# Altium schematic sheet ethernet.SchDoc
size A4
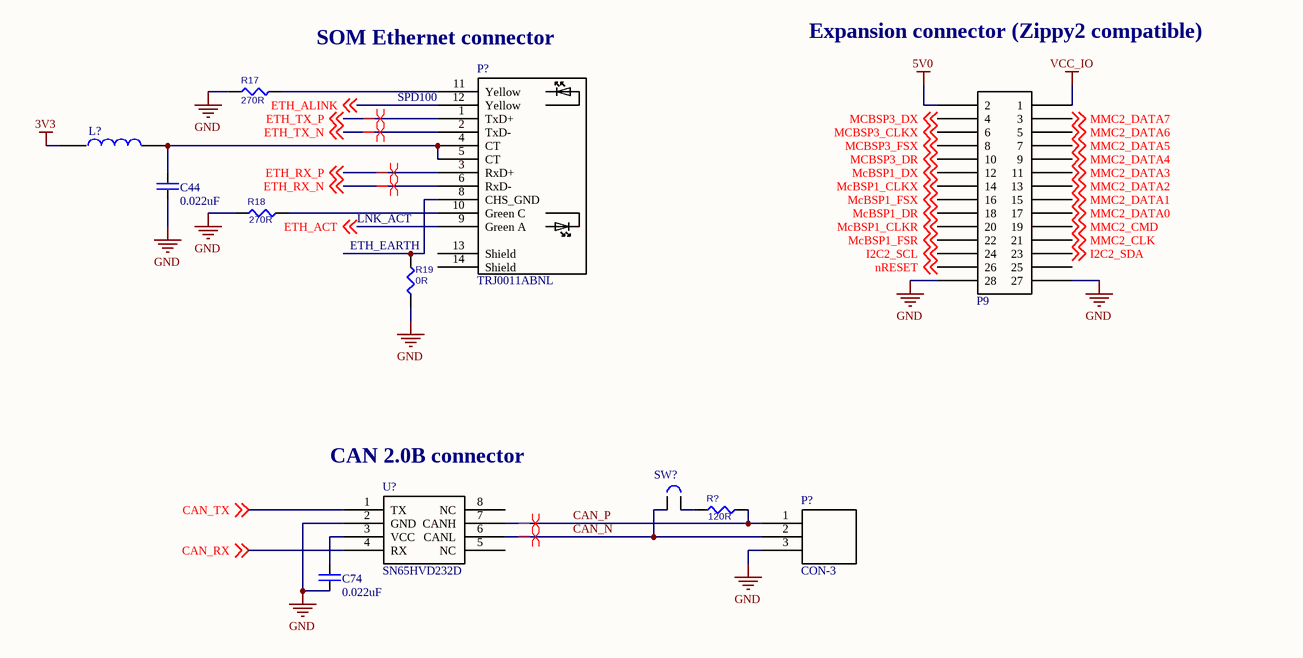
[diagram p0: ethernet.SchDoc]

## Parts
(Parts that share a designator on the sheet are numbered #1, #2 ... from top to bottom, then left to right.)
C44  value 0.022uF  [CHIP0603]  (hidden comment: C0603)
C74  value 0.022uF  [CHIP0603]  (hidden comment: C0603)
L?  BLM18A-FB  [CHIP0603]  (value not drawn)
P9  PBD-28  [HDR2X14_Board2]  (value not drawn)
P?#1  TRJ0011ABNL
P?#2  CON-3
R17  value 270R  [CHIP0603]  (hidden comment: R0603)
R18  value 270R  [CHIP0603]  (hidden comment: R0603)
R19  value 0R  [CHIP0603]  (hidden comment: R0603)
R?  value 120R  [CHIP0603]  (hidden comment: R0603)
SW?  Jumper 2-pin  [JUMPER_2]  (value not drawn)
U?  SN65HVD232D

## Nets
3V3: L?.1
5V0: P9.2
GND: C44.2 C74.2 P9.27 P9.28 P?#2.3 R17.1 R18.1 R19.1 U?.2(GND)
VCC_IO: P9.1
CAN_N: P?#2.2 SW?.1 U?.6(CANL)
CAN_P: P?#2.1 R?.2 U?.7(CANH)
CAN_RX: U?.4(RX) ; off-sheet CAN_RX
CAN_TX: U?.1(TX) ; off-sheet CAN_TX
ETH_ACT: P?#1.9(Green_A) ; off-sheet ETH_ACT
ETH_ALINK: P?#1.12(Yellow) ; off-sheet ETH_ALINK
ETH_RX_N: P?#1.6(RxD-) ; off-sheet ETH_RX_N
ETH_RX_P: P?#1.3(RxD+) ; off-sheet ETH_RX_P
ETH_TX_N: P?#1.2(TxD-) ; off-sheet ETH_TX_N
ETH_TX_P: P?#1.1(TxD+) ; off-sheet ETH_TX_P
I2C2_SCL: P9.24 ; off-sheet I2C2_SCL
I2C2_SDA: P9.23 ; off-sheet I2C2_SDA
McBSP1_CLKR: P9.20 ; off-sheet McBSP1_CLKR
McBSP1_CLKX: P9.14 ; off-sheet McBSP1_CLKX
McBSP1_DR: P9.18 ; off-sheet McBSP1_DR
McBSP1_DX: P9.12 ; off-sheet McBSP1_DX
McBSP1_FSR: P9.22 ; off-sheet McBSP1_FSR
McBSP1_FSX: P9.16 ; off-sheet McBSP1_FSX
MCBSP3_CLKX: P9.6 ; off-sheet MCBSP3_CLKX
MCBSP3_DR: P9.10 ; off-sheet MCBSP3_DR
MCBSP3_DX: P9.4 ; off-sheet MCBSP3_DX
MCBSP3_FSX: P9.8 ; off-sheet MCBSP3_FSX
MMC2_CLK: P9.21 ; off-sheet MMC2_CLK
MMC2_CMD: P9.19 ; off-sheet MMC2_CMD
MMC2_DATA0: P9.17 ; off-sheet MMC2_DATA0
MMC2_DATA1: P9.15 ; off-sheet MMC2_DATA1
MMC2_DATA2: P9.13 ; off-sheet MMC2_DATA2
MMC2_DATA3: P9.11 ; off-sheet MMC2_DATA3
MMC2_DATA4: P9.9 ; off-sheet MMC2_DATA4
MMC2_DATA5: P9.7 ; off-sheet MMC2_DATA5
MMC2_DATA6: P9.5 ; off-sheet MMC2_DATA6
MMC2_DATA7: P9.3 ; off-sheet MMC2_DATA7
nRESET: P9.26 ; off-sheet nRESET
NetC44_1: C44.1 L?.2 P?#1.4(CT) P?#1.5(CT)
NetC74_1: C74.1 U?.3(VCC)
NetP?#1_8: P?#1.8(CHS_GND) R19.2
NetP?#1_10: P?#1.10(Green_C) R18.2
NetP?#1_11: P?#1.11(Yellow) R17.2
NetR?_1: R?.1 SW?.2

Not connected (* = marked no-connect by the designer): P9 25; P?#1 13(Shield) 14(Shield); U? 5(NC) 8(NC)

## Layout directives
differential pair: CAN_N, CAN_P, ETH_RX_N, ETH_RX_P, ETH_TX_N, ETH_TX_P

## Notes on the sheet
- SOM Ethernet connector
- Expansion connector (Zippy2 compatible)
- (near P?#1) SPD100
- (near R19) LNK_ACT
- (near R19) ETH_EARTH
- (near U?) CAN 2.0B connector

## Library data of the parts
C44 C74 = C0603: Ceramic capacitor C0603
L? = BLM18A-FB: Chip EMIFILr Inductor Type; Manufacturer: Murata; Man P/N: BLM18PG121SN1D
P9 = PBD-28: 2.54x2.54mm double row connector, 28pins; Vendor: Major League; Man P/N: LSWSS-128-D-02-G
P?#1 = TRJ0011ABNL: Network filter/connector RJ45; Manufacturer: Trxcom; Vendor: Eltech.spb.ru; Man P/N: TRJ0011ABNL
P?#2 = CON-3: 2.54mm connector
R17-R19 R? = R0603: Resistor 0603
SW? = Jumper 2-pin: Jumper 2-pin 2.54mm
U? = SN65HVD232D: 3.3-V CAN TRANSCEIVER; Manufacturer: Texas Instruments; Man P/N: SN65HVD232D